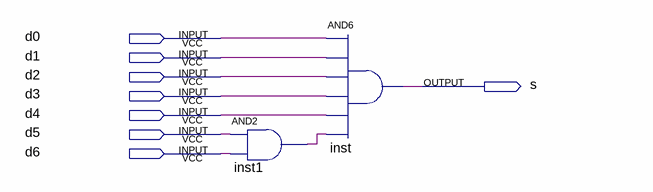
[diagram p0: schematic sheet]
// Quartus schematic and_7.bdf as structural Verilog: 2 symbols, 8 pins
module and_7 (
  input  d0,
  input  d1,
  input  d2,
  input  d3,
  input  d4,
  input  d5,
  input  d6,
  output s
);

  wire inst1_out;

  and inst1 (inst1_out, d5, d6);
  and inst (s, d0, d1, d2, d3, d4, inst1_out);
endmodule
